# EAGLE design stepper_simple (EAGLE 6.4)
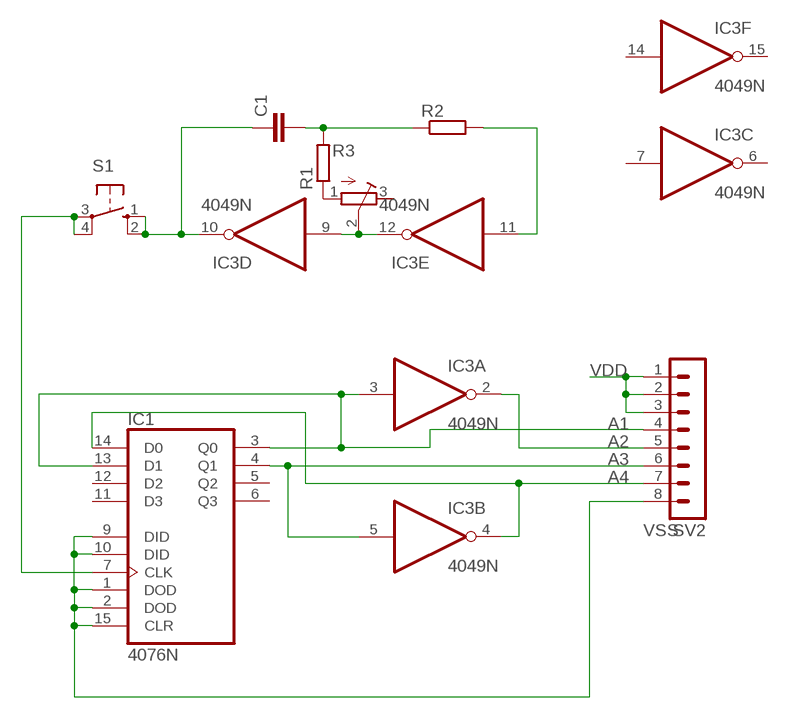
[diagram p0: schematic, sheet 1]

## Parts
C1  C-EU050-024X044  [C050-024X044]
IC1  4076N  [DIL16]
IC3  4049N  [DIL16]
R1  R-EU_0207/10  [0207/10]
R2  R-EU_0207/10  [0207/10]
R3  R-TRIMM64W  [RTRIM64W]
S1  40-XX  [B3F-40XX]
SV2  MA08-1  [MA08-1]

## Nets
A1: IC1.3(Q0) IC1.13(D1) IC3.3(A:I) SV2.4
A2: IC3.2(A:O) SV2.5
A3: IC1.4(Q1) IC3.5(B:I) SV2.6
A4: IC1.14(D0) IC3.4(B:O) SV2.7
N$1: IC3.9(D:I) IC3.12(E:O) R3.2(S)
N$2: IC1.7(CLK) S1.3(P) S1.4(P1)
N$3: C1.2 R1.2 R2.1
N$4: IC3.11(E:I) R2.2
N$5: C1.1 IC3.10(D:O) S1.1(S) S1.2(S1)
N$6: R1.1 R3.1(A)
VDD: SV2.1 SV2.2 SV2.3
VSS: IC1.1(DOD) IC1.2(DOD) IC1.9(DID) IC1.10(DID) IC1.15(CLR) SV2.8
Unconnected: IC1.5(Q2) IC1.6(Q3) IC1.11(D3) IC1.12(D2) IC3.6(C:O) IC3.7(C:I) IC3.14(F:I) IC3.15(F:O) R3.3(E)

## Power pins joined to a net without a drawn wire
VDD: IC1.16(VDD) IC3.1(P:VDD)
VSS: IC1.8(VSS) IC3.8(P:VSS)

## Library data of the parts
C1 = rcl:C-EU: CAPACITOR, European symbol
IC1 = 40xx:4076: Quad D-type REGISTER
IC3 = 40xx:4049: Hex inverting BUFFER
R1 R2 = rcl:R-EU_: RESISTOR, European symbol
R3 = rcl:R-TRIMM: Trimm resistor
S1 = switch-omron:40-XX: OMRON SWITCH; MF: OMRON COMPONENTS USA; MPN: B3F-4000; OC_FARNELL: 176434; OC_NEWARK: 36K3105
SV2 = con-lstb:MA08-1: PIN HEADER; OC_FARNELL: unknown; OC_NEWARK: unknown

## Board
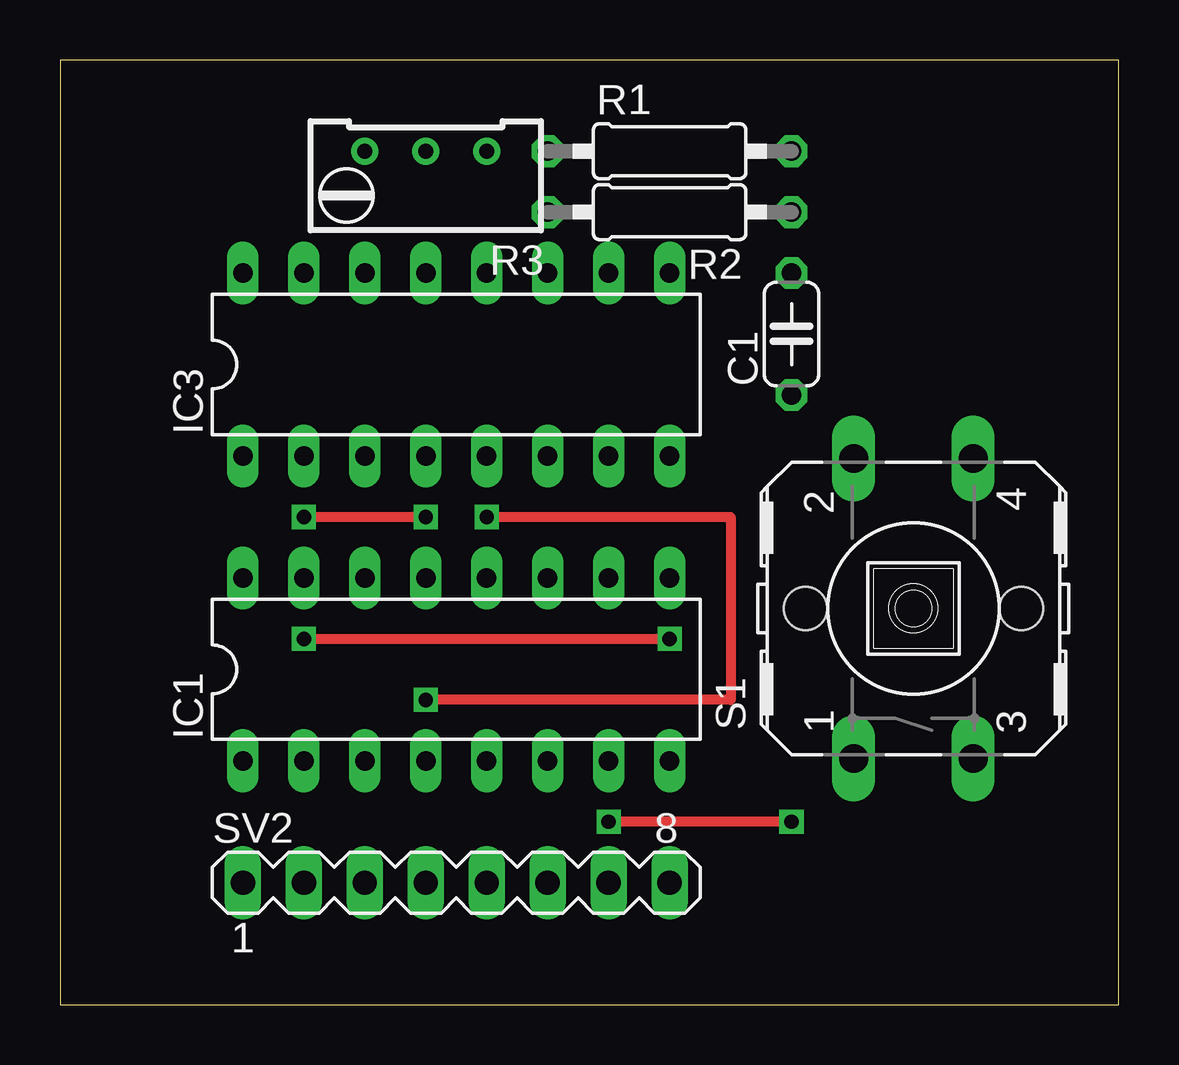
[diagram p1: board, top side]
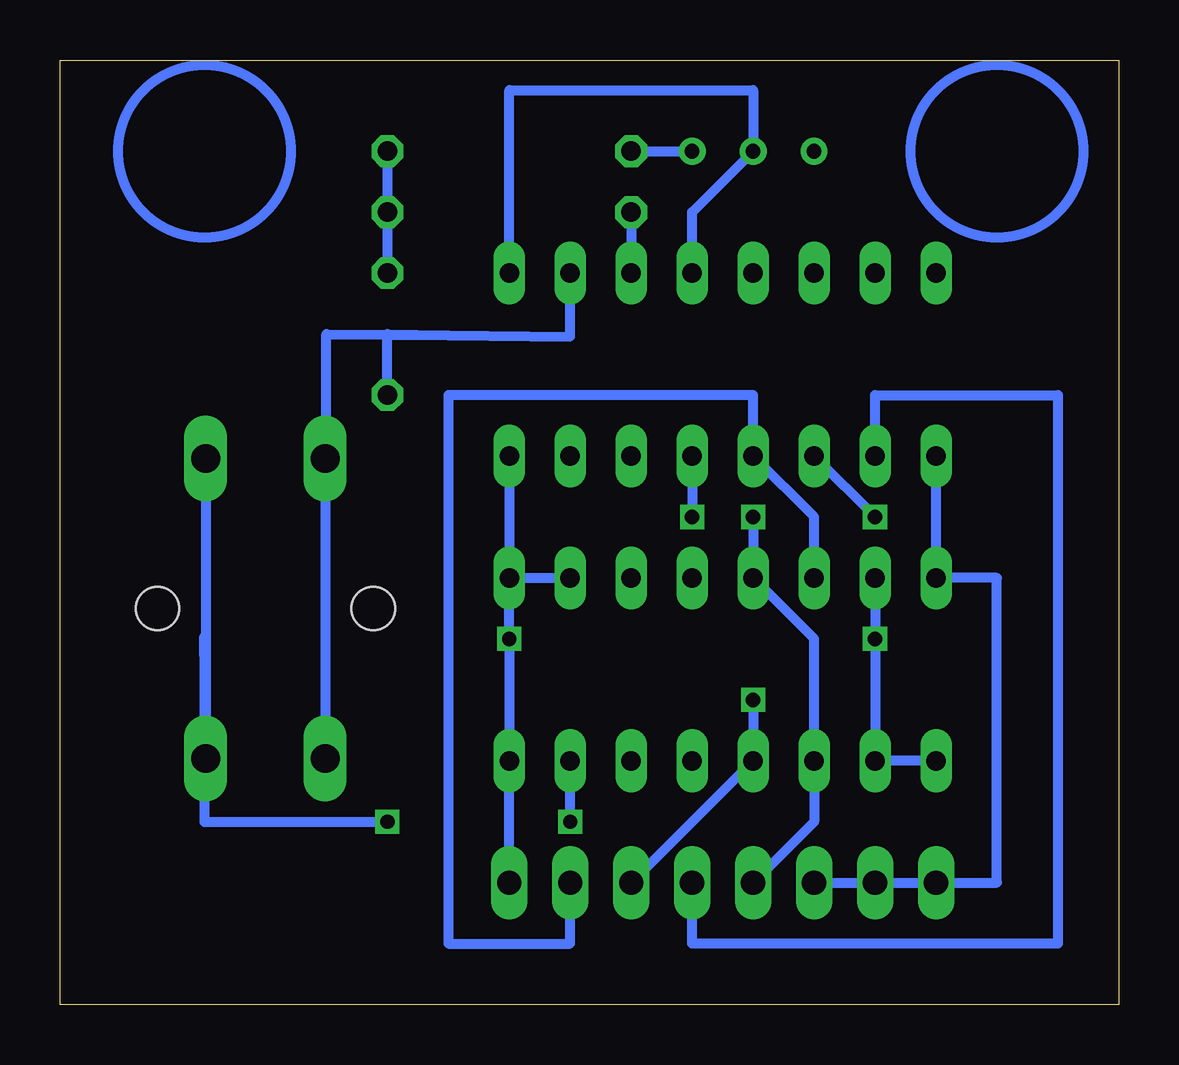
[diagram p2: board, bottom side, seen from below]

Size 44.12 x 39.36 mm. Coordinates in mm from the lower left corner, seen from the top.
Outline: 0,0 44.12,0 44.12,39.36 0,39.36 0,0
Copper layers (1*16): Top 0.035mm / dielectric 1.5mm / Bottom 0.035mm
Design rules "default": minimum track width 10mil, minimum drill 24mil, track to track 8mil, track to pad 8mil, pad to pad 8mil, via to via 8mil, smd to smd 8mil, copper to edge 40mil, drill to drill 8mil, minimum pad ring 10mil, minimum via ring 8mil, stop-mask expansion 4mil, vias tented up to drill 0mil, thermal gap 10mil

### Footprints (pad centres in the part's own frame; a part is rotated, then mirrored left to right if it is on the bottom)
C050-024X044 = drill 0.813 octagon: 1 -2.54,0; 2 2.54,0
DIL16 = drill 0.813 long: 1 -8.89,-3.81; 2 -6.35,-3.81; 3 -3.81,-3.81; 4 -1.27,-3.81; 5 1.27,-3.81; 6 3.81,-3.81; 7 6.35,-3.81; 8 8.89,-3.81; 9 8.89,3.81; 10 6.35,3.81; 11 3.81,3.81; 12 1.27,3.81; 13 -1.27,3.81; 14 -3.81,3.81; 15 -6.35,3.81; 16 -8.89,3.81
0207/10 = drill 0.813 octagon: 1 -5.08,0; 2 5.08,0
RTRIM64W = drill 0.61: 1 1.27,-2.54; 2 1.27,0; 3 1.27,2.54
B3F-40XX = drill 1.194 long: 1 -6.248,2.489; 2 6.248,2.489; 3 -6.248,-2.489; 4 6.248,-2.489 | hole 1.803: 0,-4.496; 0,4.496
MA08-1 = drill 1.016 long: 1 -8.89,0; 2 -6.35,0; 3 -3.81,0; 4 -1.27,0; 5 1.27,0; 6 3.81,0; 7 6.35,0; 8 8.89,0

### Placement (x,y rotation side)
C1  30.48,27.94 90 top
IC1  16.51,13.97 0 top
IC3  16.51,26.67 0 top
R1  25.4,35.56 0 top
R2  25.4,33.02 180 top
R3  15.24,34.29 90 top
S1  35.56,16.51 90 top
SV2  16.51,5.08 0 top

### Tracks (layer width: path | path; a pad name or v marks a point on that pad's centre or on a via)
A1  (via drill 0.6)
  Top 0.406: v10.16,20.32 v15.24,20.32
  Bottom 0.406: SV2.4 12.7,7.62 IC1.3 12.7,15.24 IC1.13 v15.24,20.32 | IC3.3 v10.16,20.32
A2
  Bottom 0.406: IC3.2 10.16,25.4 2.54,25.4 2.54,2.54 17.78,2.54 SV2.5
A3  (via drill 0.6)
  Top 0.406: v17.78,20.32 27.94,20.32 27.94,12.7 v15.24,12.7
  Bottom 0.406: SV2.6 IC1.4 v15.24,12.7 | IC3.5 v17.78,20.32
A4
  Bottom 0.406: IC1.14 12.7,20.32 IC3.4 15.24,25.4 27.94,25.4 27.94,2.54 22.86,2.54 SV2.7
N$1
  Bottom 0.406: IC3.12 17.78,33.02 R3.2 15.24,38.1 25.4,38.1 IC3.9
N$2  (via drill 0.6)
  Top 0.406: v30.48,7.62 v22.86,7.62
  Bottom 0.406: S1.4 S1.3 38.1,15.34 38.1,7.62 v30.48,7.62 | v22.86,7.62 IC1.7
N$3
  Bottom 0.406: R1.2 R2.1 C1.2
N$4
  Bottom 0.406: R2.2 IC3.11
N$5
  Bottom 0.406: 27.94,27.89 33.02,27.94 33.02,22.76 S1.2 S1.1 | 27.94,27.89 22.86,27.84 IC3.10 | C1.1 30.48,27.94 27.94,27.89
N$6
  Bottom 0.406: R1.1 R3.1
VDD
  Bottom 0.406: IC3.1 IC1.16 5.08,17.78 5.08,5.08 SV2.1 SV2.2 SV2.3
VSS  (via drill 0.6)
  Top 0.406: v10.16,15.24 v25.4,15.24
  Bottom 0.406: IC1.1 IC1.2 v10.16,15.24 IC1.15 | IC1.9 IC1.10 | SV2.8 IC1.8 v25.4,15.24 IC1.9 | IC3.8 IC1.9
(copper drawn outside any net)
  shapes: Bottom circle x2